# EAGLE design tdlf_steamy_streamer_top_modulaire (EAGLE 9.6.2)
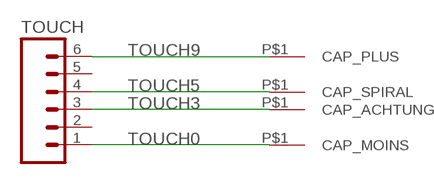
[diagram p0: schematic, sheet 1]

## Parts
CAP_PLUS  TDLF_CAP_PLUS  [TDLF_CAP_PLUS]
TOUCH  M06SMD-STRAIGHT-COMBO-FEMALE  [1X06_SMD_STRAIGHT_COMBO]
U$1  TDLF_CAP_MOINS  [TDLF_CAP_MOINS]
U$2  TDLF_CAP_SPIRAL  [TDLF_CAP_SPIRAL]
U$4  TDLF_CAP_ACHTUNG  [TDLF_CAP_ACHTUNG]

## Nets
TOUCH0: TOUCH.1 U$1.P$1(CAP_MOINS)
TOUCH3: TOUCH.3 U$4.P$1(CAP_ACHTUNG)
TOUCH5: TOUCH.4 U$2.P$1(CAP_SPIRAL)
TOUCH9: CAP_PLUS.P$1(CAP_PLUS) TOUCH.6
Unconnected: TOUCH.2 TOUCH.5

## Library data of the parts
CAP_PLUS = alx_lib:TDLF_CAP_PLUS: Capacitive plus button
TOUCH = SparkFun-Connectors:M06: Header 6 Standard 6-pin 0.1" header. Use with straight break away headers (SKU : PRT-00116), right angle break away headers (PRT-00553), swiss pins (PRT-00743), machine pins (PRT-00117), and female headers (PRT-00115). Molex polarized connector foot print use with SKU : PRT-08094 with associated crimp pins and housings. NOTES ON THE VARIANTS LOCK and LOCK_LONGPADS... This footprint was designed to help hold the alignment of a through-hole component (i.e. 6-pin header) while soldering it into place. You may notice that each hole has been shifted either up or down by 0.005 of an inch from it's more standard position (which is a perfectly straight line). This slight alteration caused the pins (the squares in the middle) to touch the edges of the holes. Because they are alternating, it causes a "brace" to hold the component in place. 0.005 has proven to be the perfect amount of "off-center" position when using our standard breakaway headers. Although looks a little odd when you look at the bare footprint, once you have a header in there, the alteration is very hard to notice. Also,if you push a header all the way into place, it is covered up entirely on the bottom side. This idea of altering the position of holes to aid alignment will be further integrated into the Sparkfun Library for other footprints. It can help hold any component with 3 or more connection pins.; PROD_ID: CONN-10203
U$1 = alx_lib:TDLF_CAP_MOINS
U$2 = alx_lib:TDLF_CAP_SPIRAL
U$4 = alx_lib:TDLF_CAP_ACHTUNG: CAPACITIVER TOUCH BUTTON ACHTUNG

## Board
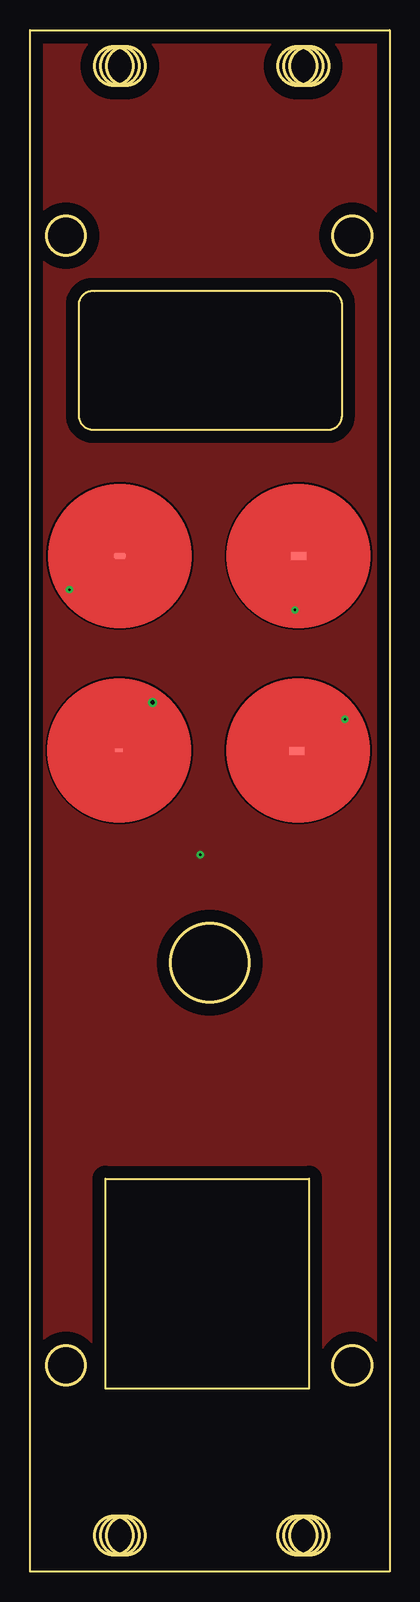
[diagram p1: board, top side]
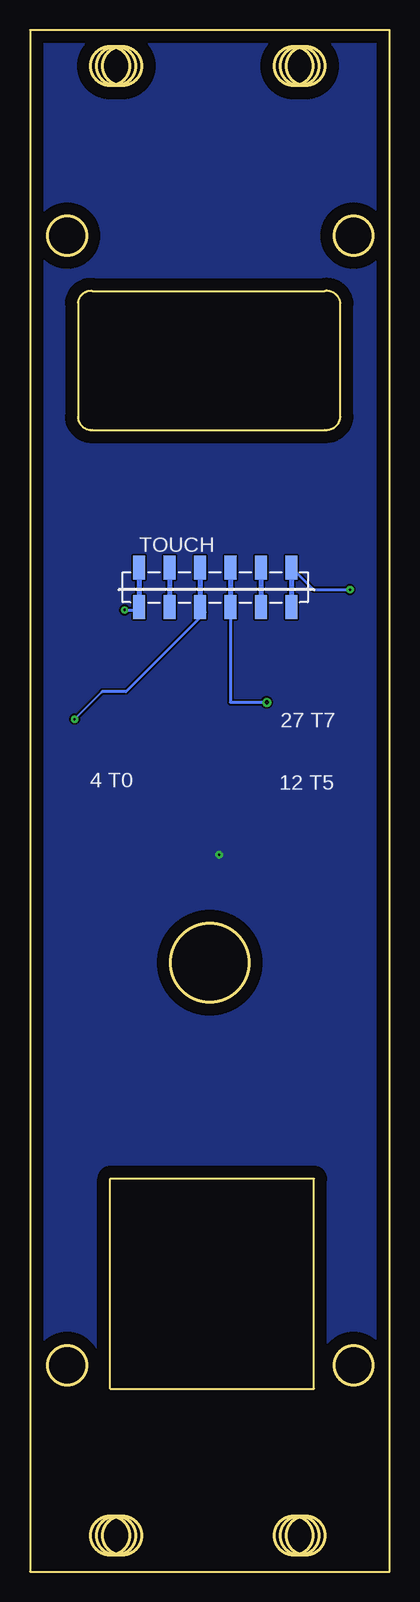
[diagram p2: board, bottom side, seen from below]

Size 30 x 128.5 mm. Coordinates in mm from the lower left corner, seen from the top.
Outline: 8,127.12 7,127.12
Outline: 7,123.88 8,123.88
Outline: 23.3,127.12 22.3,127.12
Outline: 22.3,123.88 23.3,123.88
Outline: 8,4.62 7,4.62
Outline: 7,1.38 8,1.38
Outline: 23.3,4.62 22.3,4.62
Outline: 22.3,1.38 23.3,1.38
Outline: 0,0 0,128.5 30,128.5 30,0 0,0
Outline: 24.8,106.75 5.4,106.75 arc90 4.1,105.75 4.1,96.25 arc90 5.4,95.15 24.8,95.15 arc90 26,96.25 26,105.75 arc90 24.8,106.75
Outline: 23.3,15.25 6.3,15.25 6.3,32.75 23.3,32.75 23.3,15.25
Outline: circle at 26.9,111.35 radius 1.62
Outline: circle at 3,111.35 radius 1.62
Outline: circle at 7.5,125.5 radius 1.62
Outline: circle at 7.5,3 radius 1.62
Outline: circle at 15,50.75 radius 3.25
Outline: circle at 7,125.5 radius 1.62
Outline: circle at 8,125.5 radius 1.62
Outline: circle at 22.8,125.5 radius 1.62
Outline: circle at 22.3,125.5 radius 1.62
Outline: circle at 23.3,125.5 radius 1.62
Outline: circle at 7,3 radius 1.62
Outline: circle at 8,3 radius 1.62
Outline: circle at 22.8,3 radius 1.62
Outline: circle at 22.3,3 radius 1.62
Outline: circle at 23.3,3 radius 1.62
Outline: circle at 3,17.2 radius 1.62
Outline: circle at 26.9,17.2 radius 1.62
Copper layers (1*16): Top 0.035mm / dielectric 1.5mm / Bottom 0.035mm
Design rules "default": minimum track width 6mil, minimum drill 0.35mm, track to track 6mil, track to pad 6mil, pad to pad 6mil, via to via 6mil, smd to smd 6mil, copper to edge 40mil, drill to drill 6mil, minimum pad ring 10mil, minimum via ring 8mil, stop-mask expansion 4mil, vias tented up to drill 0mil, thermal gap 10mil

### Footprints (pad centres in the part's own frame; a part is rotated, then mirrored left to right if it is on the bottom)
TDLF_CAP_PLUS = smd 1.016 x 0.508: P$1 0,0
1X06_SMD_STRAIGHT_COMBO = smd 1 x 2: 1 0,-1.65; 1-2 0,1.65; 2 2.54,1.65; 2-2 2.54,-1.65; 3 5.08,-1.65; 3-2 5.08,1.65; 4 7.62,1.65; 4-2 7.62,-1.65; 5 10.16,-1.65; 5-2 10.16,1.65; 6 12.7,1.65; 6-2 12.7,-1.65
TDLF_CAP_MOINS = smd 1.27 x 0.635: P$1 0.025,0
TDLF_CAP_SPIRAL = smd 0.61 x 0.305: P$1 -0.025,0
TDLF_CAP_ACHTUNG = smd 1.27 x 0.66: P$1 -0.102,-0.051

### Placement (x,y rotation side)
CAP_PLUS  7.5,84.65 0 top
TOUCH  20.9,82.05 0 bottom
U$1  22.4,84.65 0 top
U$2  7.44,68.45 0 top
U$4  22.38,68.45 0 top

### Tracks (layer width: path | path; a pad name or v marks a point on that pad's centre or on a via)
GND  (via drill 0.2)
  other vias: 14.2,59.75
  pour Bottom: 0,128.45 29.9,128.45 30,128.35 30,0.35 29.8,0.15 0,0.15
  pour Top: 0.2,128.46 29.9,128.16 29.9,0.25 0.2,0.25
TOUCH0  (via drill 0.2)
  Top 0.254: v22.1,80.15 22.23,80.28 U$1.P$1
  Bottom 0.254: v22.1,80.15 21.05,80.15 | 21.05,80.15 20.9,80.3 | TOUCH.1 21.05,80.25 21.05,80.15
TOUCH3  (via drill 0.2)
  Top 0.152: v26.28,71.05 24.83,71.05 U$4.P$1
  Bottom 0.152: 23.98,73.35 v26.28,71.05
  Bottom 0.254: TOUCH.3 15.4,79.98 15.4,79.93 21.98,73.35 23.98,73.35
TOUCH5  (via drill 0.35)
  Top 0.254: v10.24,72.45 7.42,69.62 U$2.P$1
  Bottom 0.254: v10.24,72.45 13.28,72.45 TOUCH.4
TOUCH9  (via drill 0.2)
  Top 0.152: CAP_PLUS.P$1 6.1,84.65 v3.3,81.85
  Bottom 0.254: TOUCH.6 6.35,81.85 v3.3,81.85

### Text on the board
bNames: 27 T7 | 12 T5 | 4 T0
tStop: tdlf steamy / streamer | v 0.1